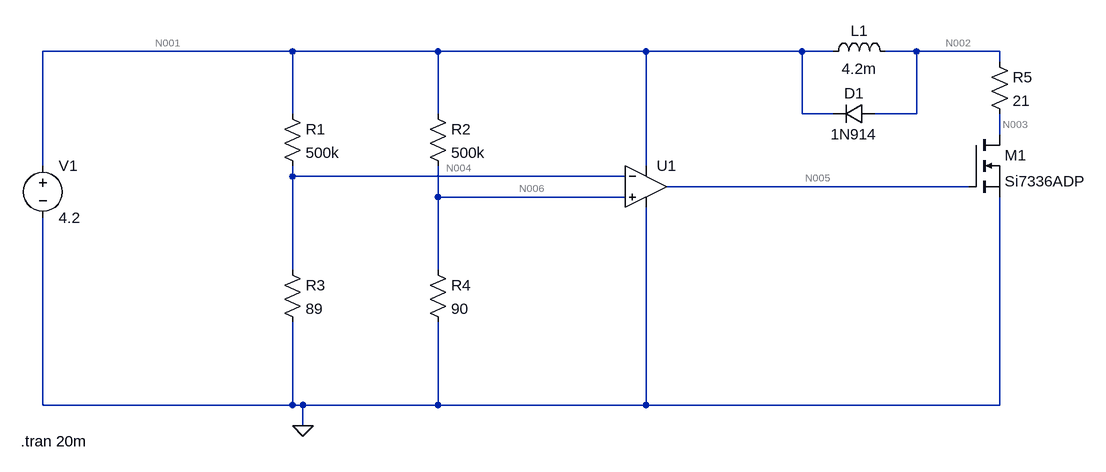
[diagram p0: schematic Simulation.asc]
Simulation.asc, the LTspice schematic file:
Version 4
SHEET 1 1644 680
WIRE 416 -80 32 -80
WIRE 640 -80 416 -80
WIRE 960 -80 640 -80
WIRE 1200 -80 960 -80
WIRE 1248 -80 1200 -80
WIRE 1376 -80 1328 -80
WIRE 1504 -80 1376 -80
WIRE 1504 -64 1504 -80
WIRE 416 16 416 -80
WIRE 640 16 640 -80
WIRE 1200 16 1200 -80
WIRE 1248 16 1200 16
WIRE 1376 16 1376 -80
WIRE 1376 16 1312 16
WIRE 1504 48 1504 16
WIRE 32 96 32 -80
WIRE 960 96 960 -80
WIRE 416 112 416 96
WIRE 928 112 416 112
WIRE 1456 128 992 128
WIRE 640 144 640 96
WIRE 928 144 640 144
WIRE 416 256 416 112
WIRE 640 256 640 144
WIRE 32 464 32 176
WIRE 416 464 416 336
WIRE 416 464 32 464
WIRE 432 464 416 464
WIRE 640 464 640 336
WIRE 640 464 432 464
WIRE 960 464 960 160
WIRE 960 464 640 464
WIRE 1504 464 1504 144
WIRE 1504 464 960 464
WIRE 432 496 432 464
FLAG 432 496 0
SYMBOL voltage 32 80 R0
WINDOW 123 0 0 Left 0
WINDOW 39 0 0 Left 0
SYMATTR InstName V1
SYMATTR Value 4.2
SYMBOL res 400 0 R0
SYMATTR InstName R1
SYMATTR Value 500k
SYMBOL res 624 0 R0
SYMATTR InstName R2
SYMATTR Value 500k
SYMBOL res 400 240 R0
SYMATTR InstName R3
SYMATTR Value 89
SYMBOL res 624 240 R0
SYMATTR InstName R4
SYMATTR Value 90
SYMBOL OpAmps\\UniversalOpamp2 960 128 R0
SYMATTR InstName U1
SYMBOL nmos 1456 48 R0
SYMATTR InstName M1
SYMATTR Value Si7336ADP
SYMBOL ind 1232 -64 R270
WINDOW 0 32 56 VTop 2
WINDOW 3 5 56 VBottom 2
SYMATTR InstName L1
SYMATTR Value 4.2m
SYMBOL res 1488 -80 R0
SYMATTR InstName R5
SYMATTR Value 21
SYMBOL diode 1312 0 R90
WINDOW 0 0 32 VBottom 2
WINDOW 3 32 32 VTop 2
SYMATTR InstName D1
SYMATTR Value 1N914
TEXT -2 520 Left 2 !.tran 20m

The netlist it stands for:
* Simulation.asc
V1 N001 0 4.2
R1 N001 N004 500k
R2 N001 N006 500k
R3 N004 0 89
R4 N006 0 90
XU1 N006 N004 N001 0 N005 level.2 Avol=1Meg GBW=10Meg Slew=10Meg ilimit=25m rail=0 Vos=0 phimargin=45 en=0 enk=0 in=0 ink=0 Rin=500Meg  ; pins IN+ IN- V+ V- OUT
M1 N003 N005 0 0 Si7336ADP
L1 N001 N002 4.2m
R5 N002 N003 21
D1 N002 N001 1N914
.model D D
.lib standard.dio
.model NMOS NMOS
.model PMOS PMOS
.lib standard.mos
.tran 20m
.lib UniversalOpamps2.sub
.backanno
.end

* Results of the author's LTspice run, read from the files saved beside the schematic
* Operating Point, zero values left out:
*   V(n001) = 4.2 V
*   V(n004) = 747.8 µV
*   V(n006) = 756.2 µV
*   V(n005) = 4.146 V
*   V(n003) = 701.6 µV
*   V(n002) = 4.2 V
*   Id(M1) = 200 mA
*   Is(M1) = -200 mA
*   I(D1) = -11.1 pA
*   I(L1) = 200 mA
*   I(R5) = 200 mA
*   I(R4) = 8.403 µA
*   I(R3) = 8.403 µA
*   I(R2) = 8.398 µA
*   I(R1) = 8.399 µA
*   I(V1) = -200 mA
*   Ix(u1:1) = -4.198 nA
*   Ix(u1:2) = -4.199 nA
*   Ix(u1:3) = 47.19 µA
*   Ix(u1:4) = -47.2 µA